# EAGLE schematic Schematic (EAGLE 8.3.2)
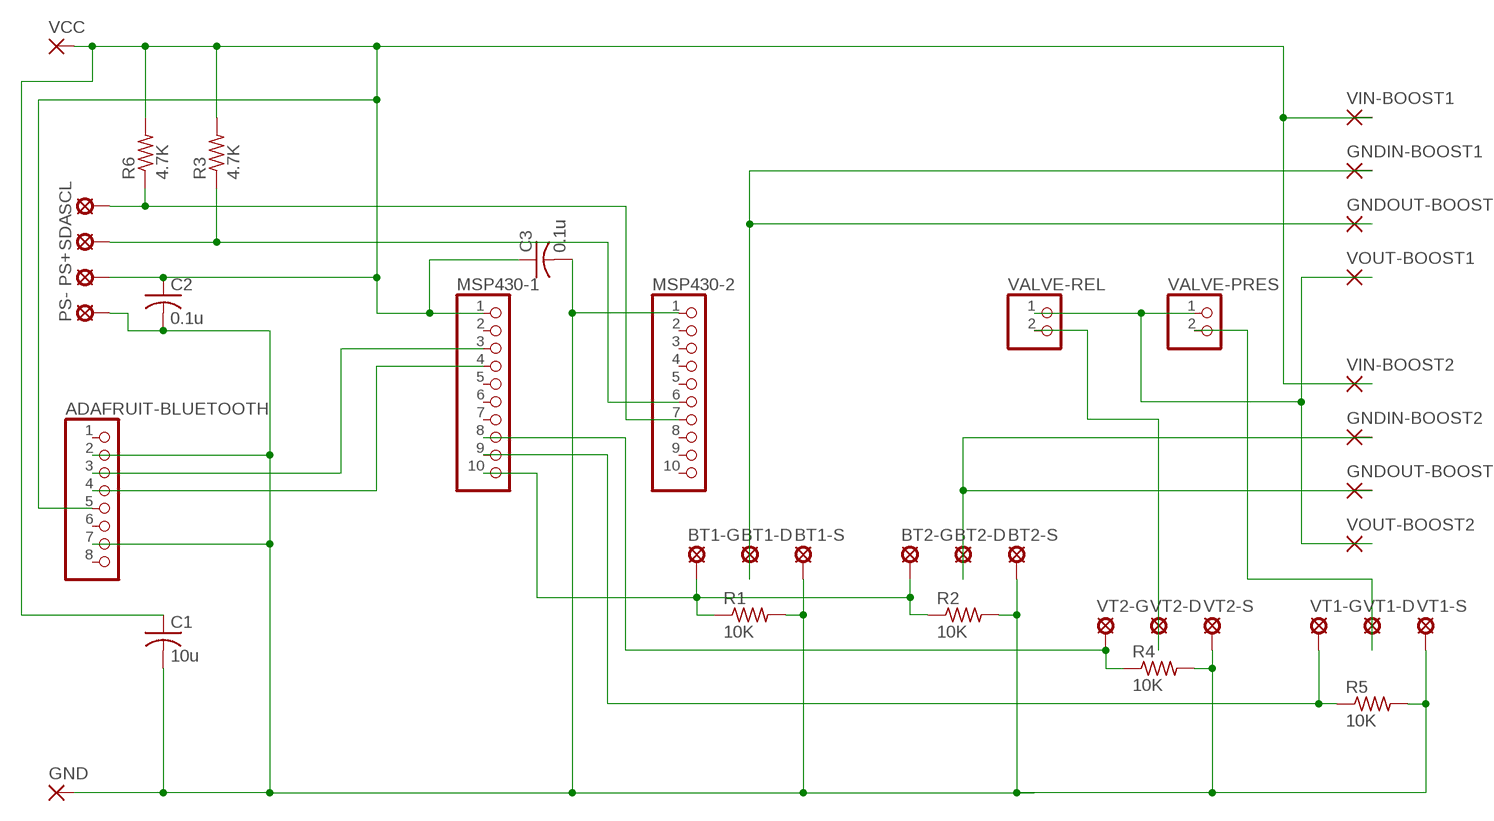
[diagram p0: schematic, sheet 1]

## Parts
ADAFRUIT-BLUETOOTH  PINHD-1X8  [1X08]
BT1-D  LSP10  [LSP10]
BT1-G  LSP10  [LSP10]
BT1-S  LSP10  [LSP10]
BT2-D  LSP10  [LSP10]
BT2-G  LSP10  [LSP10]
BT2-S  LSP10  [LSP10]
C1  10u  C-USC0805  [C0805]
C2  0.1u  C-USC0805  [C0805]
C3  0.1u  C-USC0805  [C0805]
GND  SMD5  [SMD2,54-5,08]
GNDIN-BOOST1  SMD5  [SMD2,54-5,08]
GNDIN-BOOST2  SMD5  [SMD2,54-5,08]
GNDOUT-BOOST1  SMD5  [SMD2,54-5,08]
GNDOUT-BOOST2  SMD5  [SMD2,54-5,08]
MSP430-1  PINHD-1X10  [1X10]
MSP430-2  PINHD-1X10  [1X10]
PS+  LSP10  [LSP10]
PS-  LSP10  [LSP10]
R1  10K  R-US_0309/12  [0309/12]
R2  10K  R-US_0309/12  [0309/12]
R3  4.7K  R-US_0309/12  [0309/12]
R4  10K  R-US_0309/12  [0309/12]
R5  10K  R-US_0309/12  [0309/12]
R6  4.7K  R-US_0309/12  [0309/12]
SCL  LSP10  [LSP10]
SDA  LSP10  [LSP10]
VALVE-PRES  PINHD-1X2  [1X02]
VALVE-REL  PINHD-1X2  [1X02]
VCC  SMD5  [SMD2,54-5,08]
VIN-BOOST1  SMD5  [SMD2,54-5,08]
VIN-BOOST2  SMD5  [SMD2,54-5,08]
VOUT-BOOST1  SMD5  [SMD2,54-5,08]
VOUT-BOOST2  SMD5  [SMD2,54-5,08]
VT1-D  LSP10  [LSP10]
VT1-G  LSP10  [LSP10]
VT1-S  LSP10  [LSP10]
VT2-D  LSP10  [LSP10]
VT2-G  LSP10  [LSP10]
VT2-S  LSP10  [LSP10]

## Nets
N$1: MSP430-2.7 R6.1 SCL.MP
N$3: MSP430-2.6 R3.1 SDA.MP
N$4: ADAFRUIT-BLUETOOTH.5 C1.1 C2.1 C3.1 MSP430-1.1 PS+.MP R3.2 R6.2 VCC.1(P) VIN-BOOST1.1(P) VIN-BOOST2.1(P)
N$5: ADAFRUIT-BLUETOOTH.3 MSP430-1.3
N$6: ADAFRUIT-BLUETOOTH.4 MSP430-1.4
N$7: VALVE-PRES.1 VALVE-REL.1 VOUT-BOOST1.1(P) VOUT-BOOST2.1(P)
N$8: ADAFRUIT-BLUETOOTH.2 ADAFRUIT-BLUETOOTH.7 BT1-S.MP BT2-S.MP C1.2 C2.2 C3.2 GND.1(P) MSP430-2.1 PS-.MP R1.2 R2.2 R4.2 R5.2 VT1-S.MP VT2-S.MP
N$9: MSP430-1.8 R4.1 VT2-G.MP
N$10: BT1-G.MP BT2-G.MP MSP430-1.10 R1.1 R2.1
N$11: MSP430-1.9 R5.1 VT1-G.MP
N$12: VALVE-PRES.2 VT1-D.MP
N$13: VALVE-REL.2 VT2-D.MP
N$14: BT1-D.MP GNDIN-BOOST1.1(P) GNDOUT-BOOST1.1(P)
N$15: BT2-D.MP GNDIN-BOOST2.1(P) GNDOUT-BOOST2.1(P)
Unconnected: ADAFRUIT-BLUETOOTH.1 ADAFRUIT-BLUETOOTH.6 ADAFRUIT-BLUETOOTH.8 MSP430-1.2 MSP430-1.5 MSP430-1.6 MSP430-1.7 MSP430-2.2 MSP430-2.3 MSP430-2.4 MSP430-2.5 MSP430-2.8 MSP430-2.9 MSP430-2.10

## Library data of the parts
ADAFRUIT-BLUETOOTH = pinhead:PINHD-1X8: PIN HEADER
BT1-D BT1-G BT1-S BT2-D BT2-G BT2-S PS+ PS- SCL SDA VT1-D VT1-G VT1-S VT2-D VT2-G VT2-S = solpad:LSP10: SOLDER PAD drill 1.0 mm, distributor Buerklin, 12H555
C1-C3 = resistor:C-US: CAPACITOR, American symbol
GND GNDIN-BOOST1 GNDIN-BOOST2 GNDOUT-BOOST1 GNDOUT-BOOST2 VCC VIN-BOOST1 VIN-BOOST2 VOUT-BOOST1 VOUT-BOOST2 = wirepad:SMD5: SMD PAD
MSP430-1 MSP430-2 = pinhead:PINHD-1X10: PIN HEADER
R1-R6 = resistor:R-US_: RESISTOR, American symbol
VALVE-PRES VALVE-REL = pinhead:PINHD-1X2: PIN HEADER